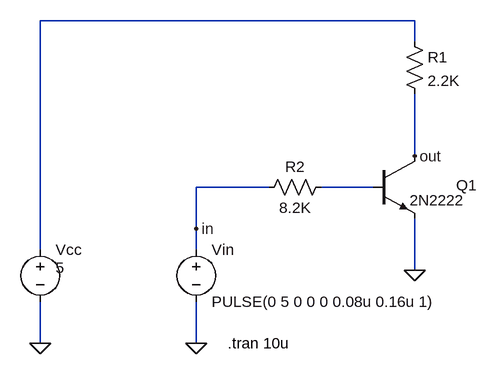
[diagram p0: schematic 1.asc]
1.asc, the LTspice schematic file:
Version 4
SHEET 1 880 680
WIRE 112 -128 -464 -128
WIRE 112 -96 112 -128
WIRE 112 80 112 -16
WIRE -112 128 -224 128
WIRE 48 128 -32 128
WIRE -224 192 -224 128
WIRE -464 224 -464 -128
WIRE -224 224 -224 192
WIRE 112 256 112 176
WIRE -464 368 -464 304
WIRE -224 368 -224 304
FLAG 112 256 0
FLAG -224 368 0
FLAG -464 368 0
FLAG -224 192 in
FLAG 112 80 out
SYMBOL npn 48 80 R0
WINDOW 0 128 45 Left 2
SYMATTR InstName Q1
SYMATTR Value 2N2222
SYMBOL res 96 -112 R0
SYMATTR InstName R1
SYMATTR Value 2.2K
SYMATTR SpiceLine tol=0 pwr=0
SYMBOL res -16 112 R90
WINDOW 0 0 56 VBottom 2
WINDOW 3 32 56 VTop 2
SYMATTR InstName R2
SYMATTR Value 8.2K
SYMATTR SpiceLine tol=0 pwr=0
SYMBOL voltage -224 208 R0
WINDOW 123 0 0 Left 0
WINDOW 39 0 0 Left 0
SYMATTR InstName Vin
SYMATTR Value PULSE(0 5 0 0 0 0.08u 0.16u 1)
SYMBOL voltage -464 208 R0
WINDOW 123 0 0 Left 0
WINDOW 39 0 0 Left 0
WINDOW 3 24 44 Left 2
SYMATTR Value 5
SYMATTR InstName Vcc
TEXT -176 368 Left 2 !.tran 10u

The netlist it stands for:
* 1.asc
Q1 out N002 0 0 2N2222
R1 N001 out 2.2K tol=0 pwr=0
R2 N002 in 8.2K tol=0 pwr=0
Vin in 0 PULSE(0 5 0 0 0 0.08u 0.16u 1)
Vcc N001 0 5
.model NPN NPN
.model PNP PNP
.lib standard.bjt
.tran 10u
.backanno
.end